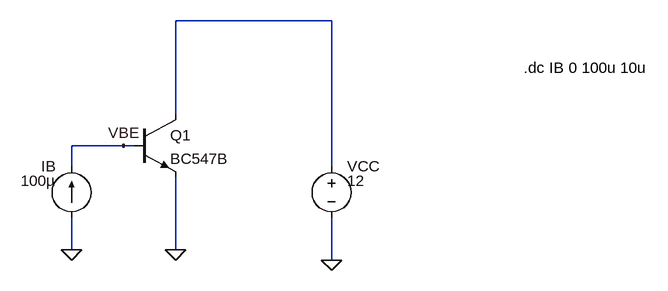
[diagram p0: schematic 3a.asc]
3a.asc, the LTspice schematic file:
Version 4
SHEET 1 1108 680
WIRE 480 160 240 160
WIRE 240 304 240 160
WIRE 160 352 80 352
WIRE 176 352 160 352
WIRE 80 384 80 352
WIRE 480 384 480 160
WIRE 80 512 80 464
WIRE 240 512 240 400
WIRE 480 528 480 464
FLAG 80 512 0
FLAG 480 528 0
FLAG 240 512 0
FLAG 160 352 VBE
SYMBOL npn 176 304 R0
SYMATTR InstName Q1
SYMATTR Value BC547B
SYMBOL current 80 464 R180
WINDOW 0 24 80 Left 2
WINDOW 3 24 58 Left 2
SYMATTR InstName IB
SYMATTR Value 100µ
SYMBOL voltage 480 368 R0
WINDOW 3 24 38 Left 2
SYMATTR InstName VCC
SYMATTR Value 12
TEXT 776 232 Left 2 !.dc IB 0 100u 10u

The netlist it stands for:
* 3a.asc
Q1 N001 VBE 0 0 BC547B
IB 0 VBE 100µ
VCC N001 0 12
.model NPN NPN
.model PNP PNP
.lib standard.bjt
.dc IB 0 100u 10u
.backanno
.end